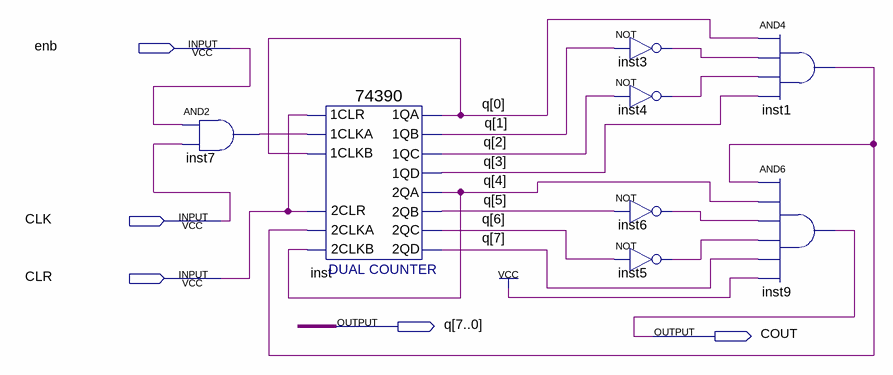
[diagram p0: schematic sheet]
// Quartus schematic COUNTER10.bdf as structural Verilog: 8 symbols, 5 pins
module COUNTER10 (
  input  enb,
  input  CLK,
  input  CLR,
  output [7:0] q,
  output COUT
);

  wire inst1_out, inst3_out, inst4_out, inst5_out, inst6_out, inst7_out;

  and inst7 (inst7_out, enb, CLK);
  \74390  inst (
    .\2CLKA (inst1_out), .\2CLR (CLR), .\2CLKB (q[4]), .\1CLR (CLR), .\1CLKA (inst7_out), .\1CLKB (q[0]),
    .\1QA (q[0]), .\1QB (q[1]), .\1QC (q[2]), .\1QD (q[3]), .\2QA (q[4]), .\2QB (q[5]), .\2QC (q[6]),
    .\2QD (q[7]));
  not inst3 (inst3_out, q[1]);
  not inst4 (inst4_out, q[2]);
  not inst6 (inst6_out, q[5]);
  not inst5 (inst5_out, q[6]);
  and inst1 (inst1_out, q[0], inst3_out, inst4_out, q[3]);
  and inst9 (COUT, inst1_out, q[4], inst6_out, inst5_out, q[7], 1'b1);
endmodule
